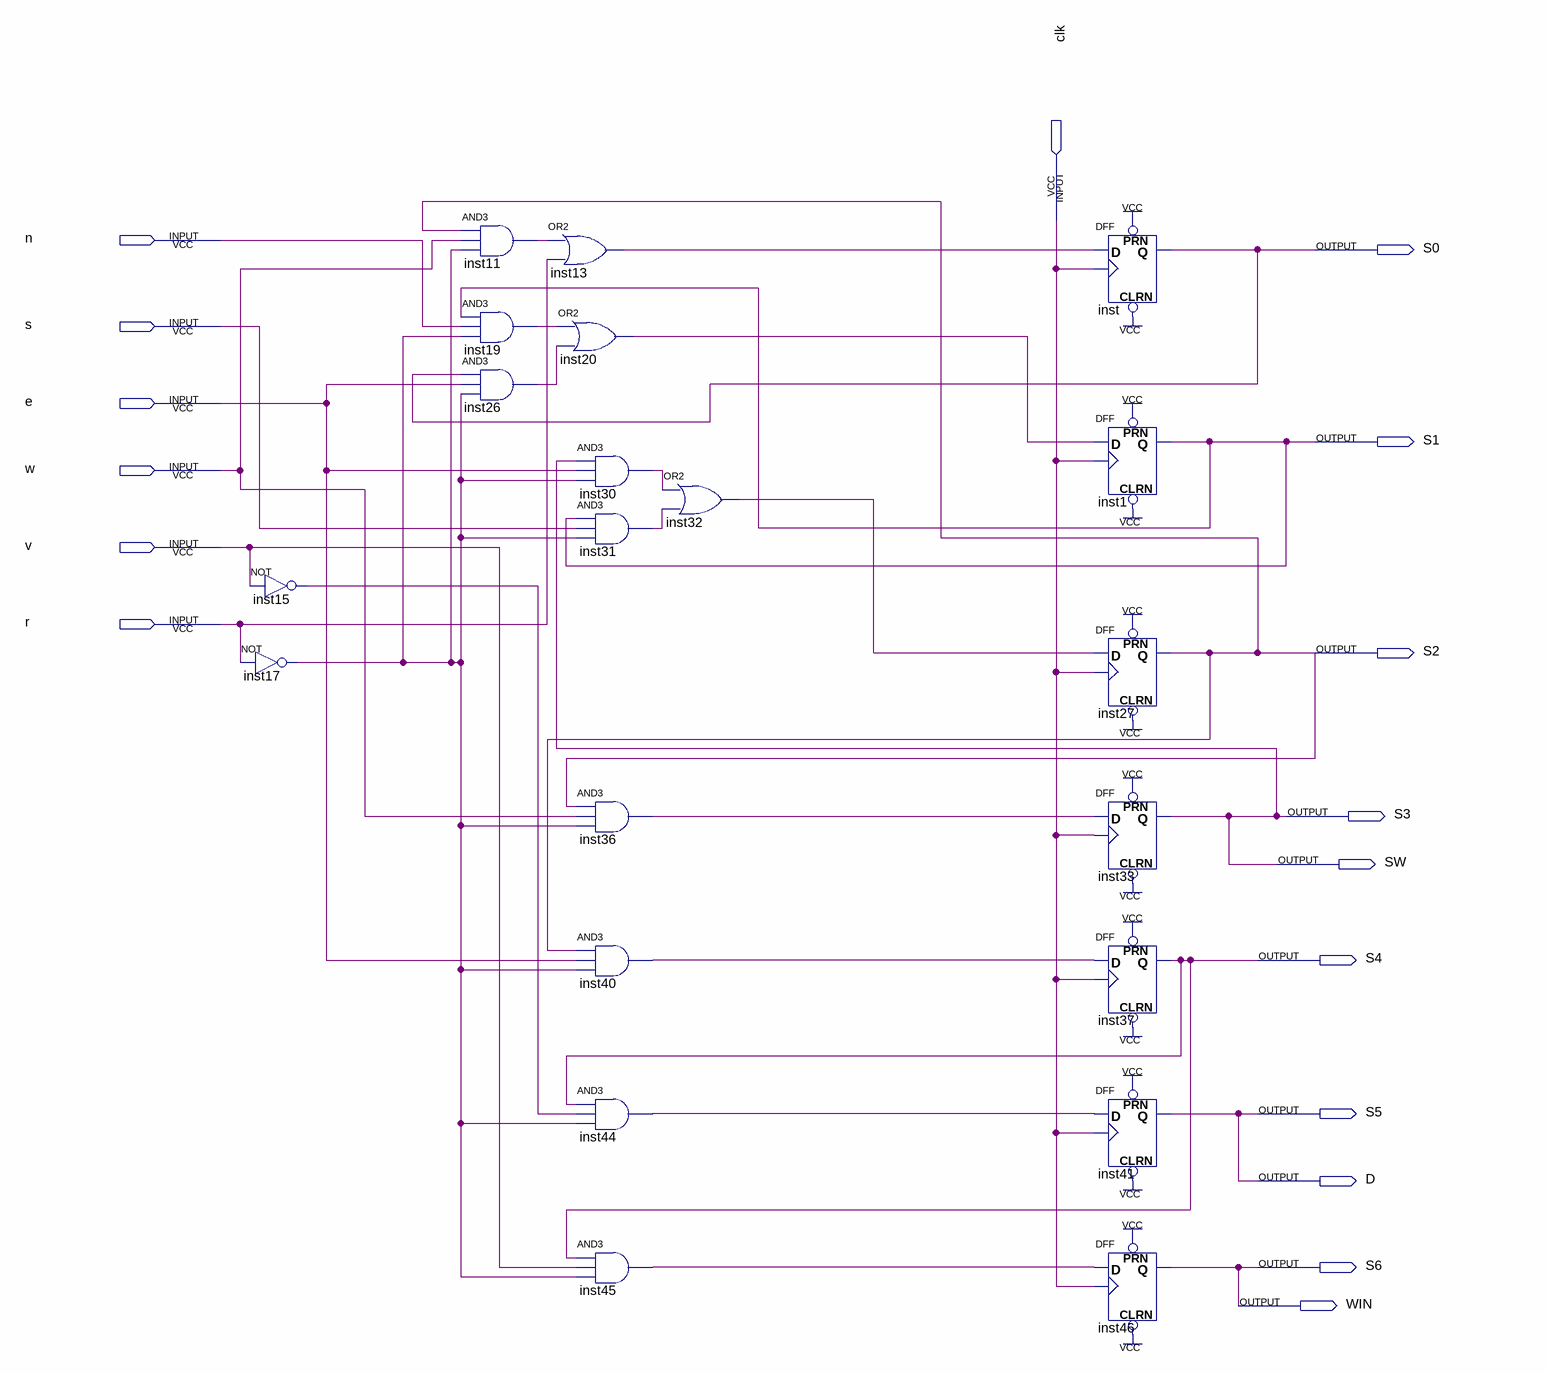
[diagram p0: schematic sheet]
// Quartus schematic room.bdf as structural Verilog: 21 symbols, 17 pins
module room (
  input  clk,
  input  n,
  input  s,
  input  e,
  input  w,
  input  v,
  input  r,
  output S0,
  output S1,
  output S2,
  output S3,
  output SW,
  output S4,
  output S5,
  output D,
  output S6,
  output WIN
);

  wire inst11_out, inst13_out, inst15_out, inst17_out, inst19_out, inst20_out, inst26_out, inst30_out,
       inst31_out, inst32_out, inst36_out, inst40_out, inst44_out, inst45_out;

  not inst17 (inst17_out, r);
  not inst15 (inst15_out, v);
  and inst11 (inst11_out, S2, w, inst17_out);
  and inst19 (inst19_out, S1, n, inst17_out);
  and inst26 (inst26_out, S0, e, inst17_out);
  or inst13 (inst13_out, inst11_out, r);
  or inst20 (inst20_out, inst19_out, inst26_out);
  and inst30 (inst30_out, S3, e, inst17_out);
  and inst31 (inst31_out, S1, s, inst17_out);
  and inst36 (inst36_out, S2, w, inst17_out);
  and inst40 (inst40_out, S2, e, inst17_out);
  and inst44 (inst44_out, S4, inst15_out, inst17_out);
  and inst45 (inst45_out, S4, v, inst17_out);
  or inst32 (inst32_out, inst30_out, inst31_out);
  DFF inst (.CLRN(1'b1), .CLK(clk), .D(inst13_out), .PRN(1'b1), .Q(S0));
  DFF inst1 (.CLRN(1'b1), .CLK(clk), .D(inst20_out), .PRN(1'b1), .Q(S1));
  DFF inst27 (.CLRN(1'b1), .CLK(clk), .D(inst32_out), .PRN(1'b1), .Q(S2));
  DFF inst33 (.CLRN(1'b1), .CLK(clk), .D(inst36_out), .PRN(1'b1), .Q(S3));
  DFF inst37 (.CLRN(1'b1), .CLK(clk), .D(inst40_out), .PRN(1'b1), .Q(S4));
  DFF inst41 (.CLRN(1'b1), .CLK(clk), .D(inst44_out), .PRN(1'b1), .Q(D));
  DFF inst46 (.CLRN(1'b1), .CLK(clk), .D(inst45_out), .PRN(1'b1), .Q(S6));

  assign S5 = D;
  assign SW = S3;
  assign WIN = S6;
endmodule
